# Altium schematic sheet Sheet2.SchDoc
size A; SheetNumber: 1; SheetTotal: 1; SPICEModelCacheYZIQGRCI: <root> / <DocumentId>YZIQGRCI</DocumentId> / </root>
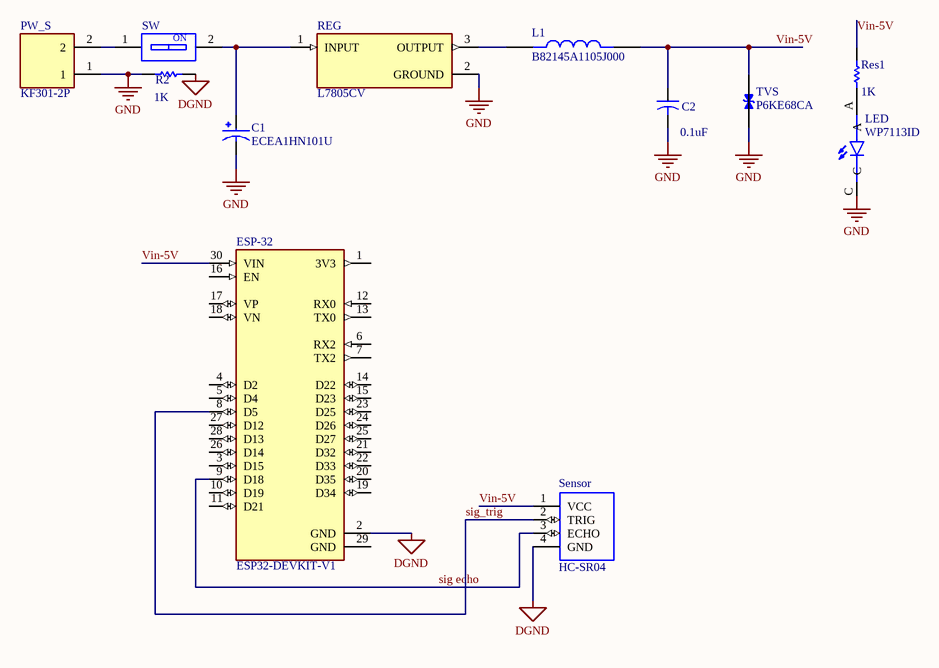
[diagram p0: Sheet2.SchDoc]

## Parts
C1  ECEA1HN101U  [CAPPRD500W60D1000H2000]
C2  value 0.1uF  [CAPR5-4X5]  (hidden comment: Cap2)
ESP-32  ESP32-DEVKIT-V1  [MODULE_ESP32_DEVKIT_V1]
L1  B82145A1105J000  [INDAD1680W80L1200D650]
LED  WP7113ID  [LED_WP7113ID]
PW_S  KF301-2P  [HANDSON_KF301-2P]
R2  value 1K  [AXIAL-0.3]  (hidden comment: Res1)
REG  L7805CV  [TO255P1040X460X1968-3]
Res1  value 1K  [AXIAL-0.3]  (hidden comment: Res1)
Sensor  HC-SR04  [XCVR_HC-SR04]
SW  418117170901  [418117170901]  (value not drawn)
TVS  P6KE68CA  [DIOAD1300W80L670D310]

## Nets
DGND: ESP-32.2(GND) R2.2 Sensor.4(GND)
GND: C1.N C2.2 LED.C PW_S.1 R2.1 REG.2(GROUND) TVS.1
sig echo: ESP-32.9(D18) Sensor.3(ECHO)
sig_trig: ESP-32.8(D5) Sensor.2(TRIG)
Vin-5V: C2.1 ESP-32.30(VIN) L1.2 Res1.1 Sensor.1(VCC) TVS.2
NetC1_P: C1.P REG.1(INPUT) SW.2
NetL1_1: L1.1 REG.3(OUTPUT)
NetLED_A: LED.A Res1.2
NetPW_S_2: PW_S.2 SW.1

Not connected (* = marked no-connect by the designer): ESP-32 1(3V3) 3(D15) 4(D2) 5(D4) 6(RX2) 7(TX2) 10(D19) 11(D21) 12(RX0) 13(TX0) 14(D22) 15(D23) 16(EN) 17(VP) 18(VN) 19(D34) 20(D35) 21(D32) 22(D33) 23(D25) 24(D26) 25(D27) 26(D14) 27(D12) 28(D13) 29(GND)

## Notes on the sheet
- (in symbol 418117170901) ON

## Library data of the parts
C1 = ECEA1HN101U: Capacitor [Panasonic Automotive & Industrial Systems] ECEA1HN101U Capacitor; MP: ECEA1HN101U; Check_prices: https://www.snapeda.com/parts/ECEA1HN101U/Panasonic/view-part/?ref=eda; Availability: In Stock; SnapEDA_Link: https://www.snapeda.com/parts/ECEA1HN101U/Panasonic/view-part/?ref=snap; Purchase-URL: https://pricing.snapeda.com/search/part/ECEA1HN101U/?ref=eda; Price: None; MF: Panasonic; Package: RADIAL-2 Panasonic; Value: *
C2 = Cap2: Capacitor; Published: 23-Sep-2002; PackageReference: CAPR5-4X5; Publisher: Altium Limited; PackageDescription: Capacitor; 2 Leads
ESP-32 = ESP32-DEVKIT-V1: Dual core, Wi-Fi: 2.4 GHz up to 150 Mbits/s,BLE (Bluetooth Low Energy) and legacy Bluetooth, 32 bits, Up to 240 MHz; MF: Do it; SnapEDA_Link: https://www.snapeda.com/parts/ESP32-DEVKIT-V1/Do+it/view-part/?ref=snap; Package: None; Value: *; MP: ESP32-DEVKIT-V1; Check_prices: https://www.snapeda.com/parts/ESP32-DEVKIT-V1/Do+it/view-part/?ref=eda
L1 = B82145A1105J000: FIXED IND 1MH 370MA 3.6 OHM TH; MF: TDK; Value: *; Check_prices: https://www.snapeda.com/parts/B82145A1105J000/TDK/view-part/?ref=eda; SnapEDA_Link: https://www.snapeda.com/parts/B82145A1105J000/TDK/view-part/?ref=snap; Availability: In Stock; MP: B82145A1105J000; Purchase-URL: https://pricing.snapeda.com/search/part/B82145A1105J000/?ref=eda; Package: None; Price: None
LED = WP7113ID: Red 617nm LED Indication - Discrete 2V Radial; MF: Kingbright; Price: None; MP: WP7113ID; Package: Radial Kingbright; Check_prices: https://www.snapeda.com/parts/WP7113ID/Kingbright/view-part/?ref=eda; Purchase-URL: https://pricing.snapeda.com/search/part/WP7113ID/?ref=eda; Availability: In Stock; Value: *; SnapEDA_Link: https://www.snapeda.com/parts/WP7113ID/Kingbright/view-part/?ref=snap
PW_S = KF301-2P: 2 Pin Terminal Block 5mm Pitch; MF: Handson Technology; SnapEDA_Link: https://www.snapeda.com/parts/KF301-2P/Handson+Technology/view-part/?ref=snap; Package: None; Value: *; MP: KF301-2P; Check_prices: https://www.snapeda.com/parts/KF301-2P/Handson+Technology/view-part/?ref=eda
R2 Res1 = Res1: Resistor; Published: 8-Jun-2000; LatestRevisionDate: 17-Jul-2002; LatestRevisionNote: Re-released for DXP Platform.; PackageReference: AXIAL-0.3; Publisher: Altium Limited; PackageDescription: Axial Device, Thru-Hole; 2 Leads; 0.3 in Pin Spacing
REG = L7805CV: Linear Voltage Regulator IC Positive Fixed 1 Output 1.5A TO-220; MF: STMicroelectronics; SnapEDA_Link: https://www.snapeda.com/parts/L7805CV/STMicroelectronics/view-part/?ref=snap; Package: TO-220-3 STMicroelectronics; Value: *; MP: L7805CV; Check_prices: https://www.snapeda.com/parts/L7805CV/STMicroelectronics/view-part/?ref=eda
Sensor = HC-SR04: Ultrasonic Sensor Module; Availability: Unavailable; MP: HC-SR04; Value: *; Price: None; Package: None
SW = 418117170901: WS-DITV Compact THT Dip Switch, Flat Actuator, pitch 2.54mm, 1p; Manufacturer: Wurth Elektronik; Actuator Type: Flat Type; Operation Force: 800g; Rated Current Non-Switching: 100mA; Rated Current Switching: 25mA; Rated Voltage Non-Switching: 50VDC; Rated Voltage Switching: 24VDC; Number of Poles: 1; ComponentLink1Description: Website Link; ComponentLink1URL: https://www.we-online.com/redexpert/article/418117170901?ad; ComponentLink2Description: Datasheet Link; ComponentLink2URL: https://www.we-online.com/redexpert/spec/418117170901?ad; Manufacturer Part Number: 418117170901; Category: Dip Switches; Match Code: WS-DITV; Mount: Through Hole; Operating Temperature Max: 85°C; Operating Temperature Min: -40°C; Packaging: Tube; Contact Material: Copper Alloy; Contact Plating: Gold; Pitch: 2.54mm
TVS = P6KE68CA: Package: None; Price: None; Value: *; MP: P6KE68CA; Availability: Unavailable